# EAGLE board balancer (EAGLE 9.6.2), part 1 of 2
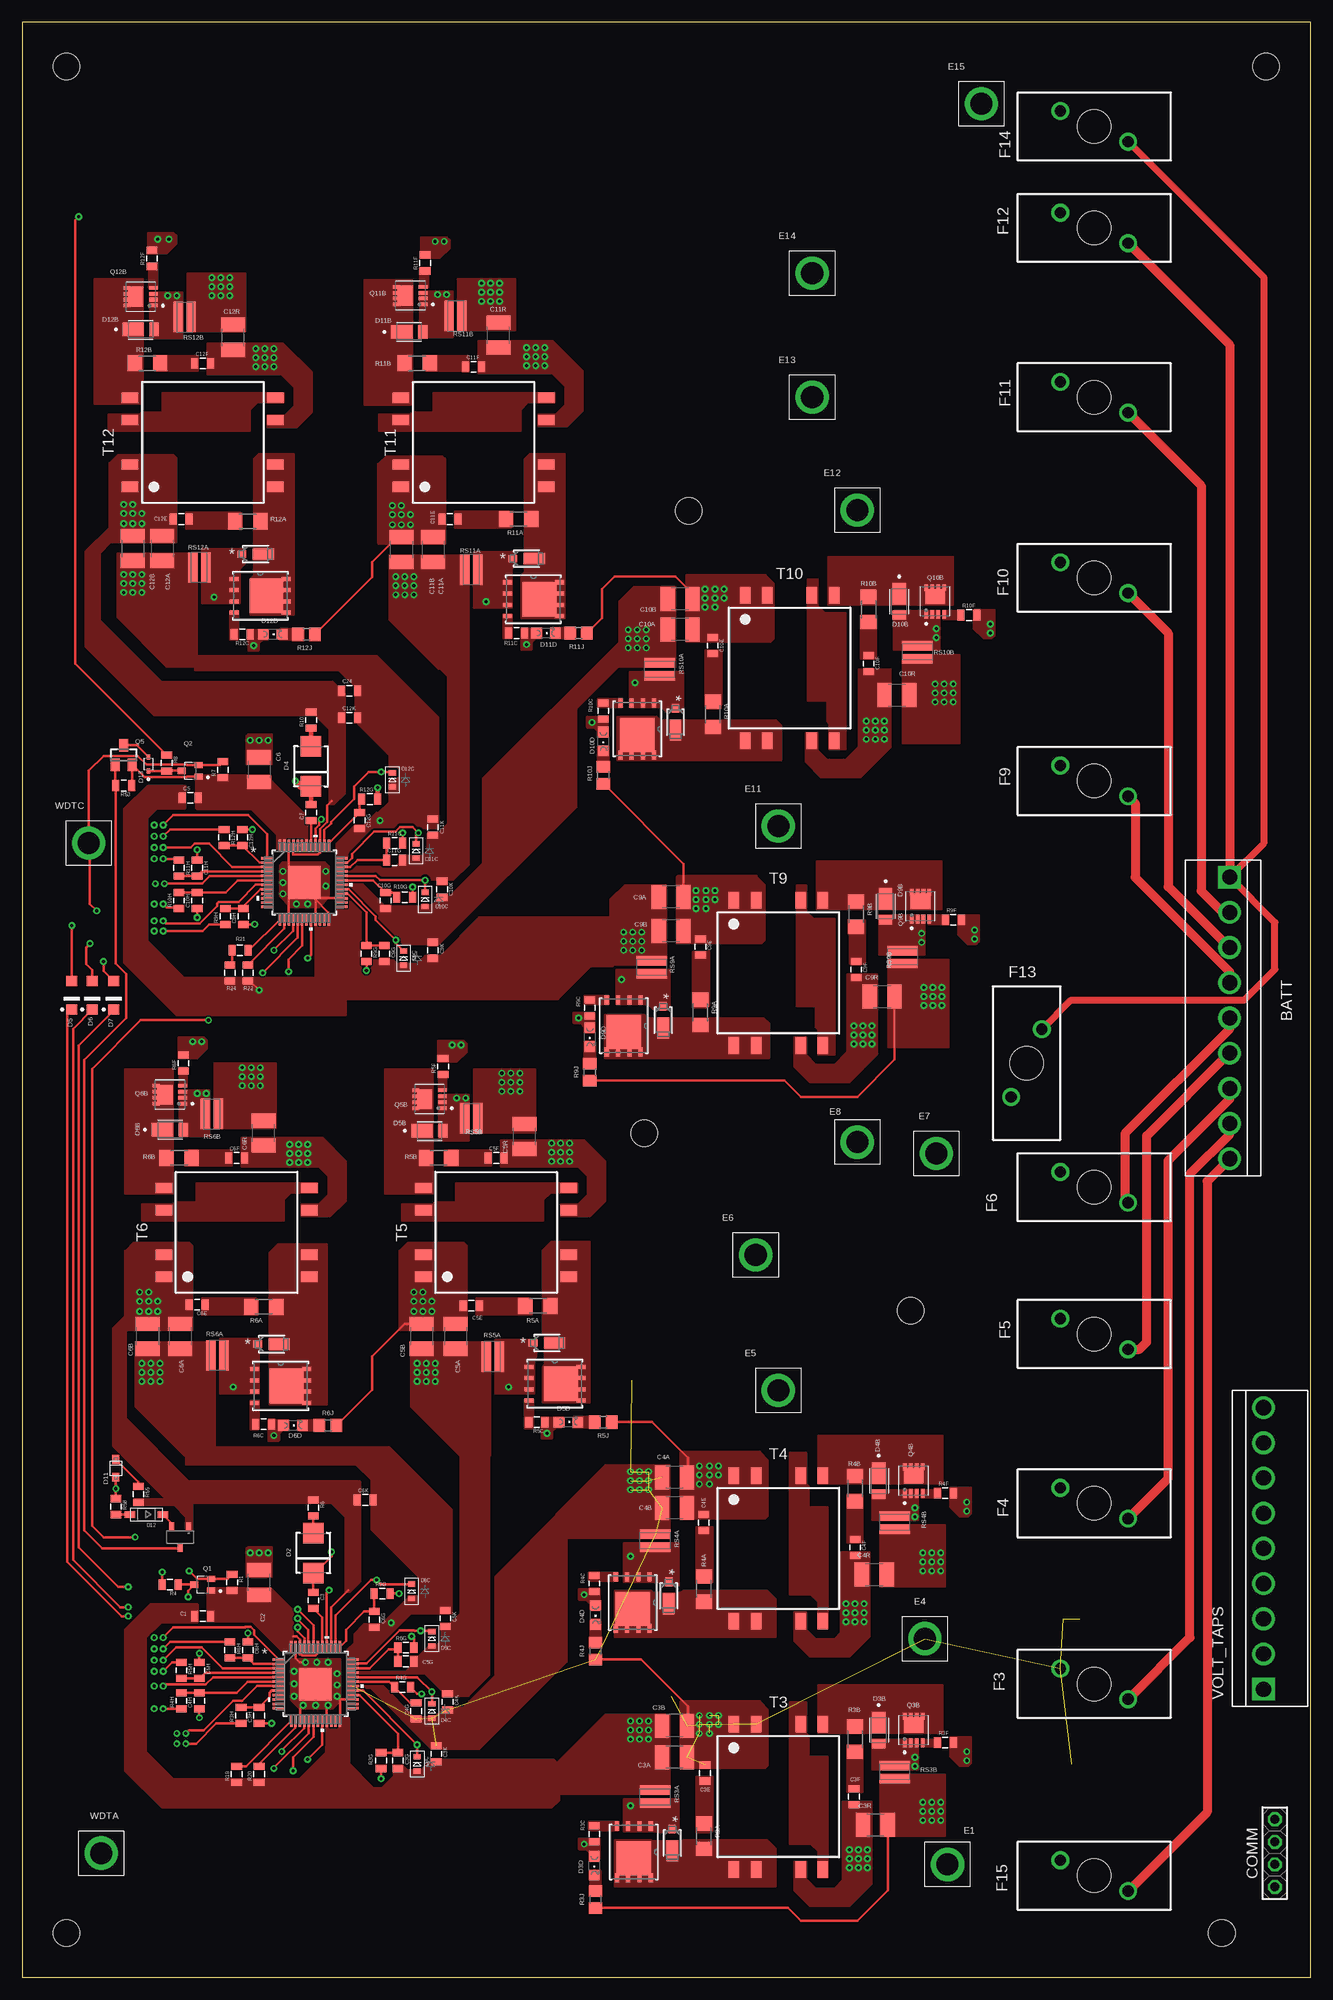
[diagram p1: board, top side]
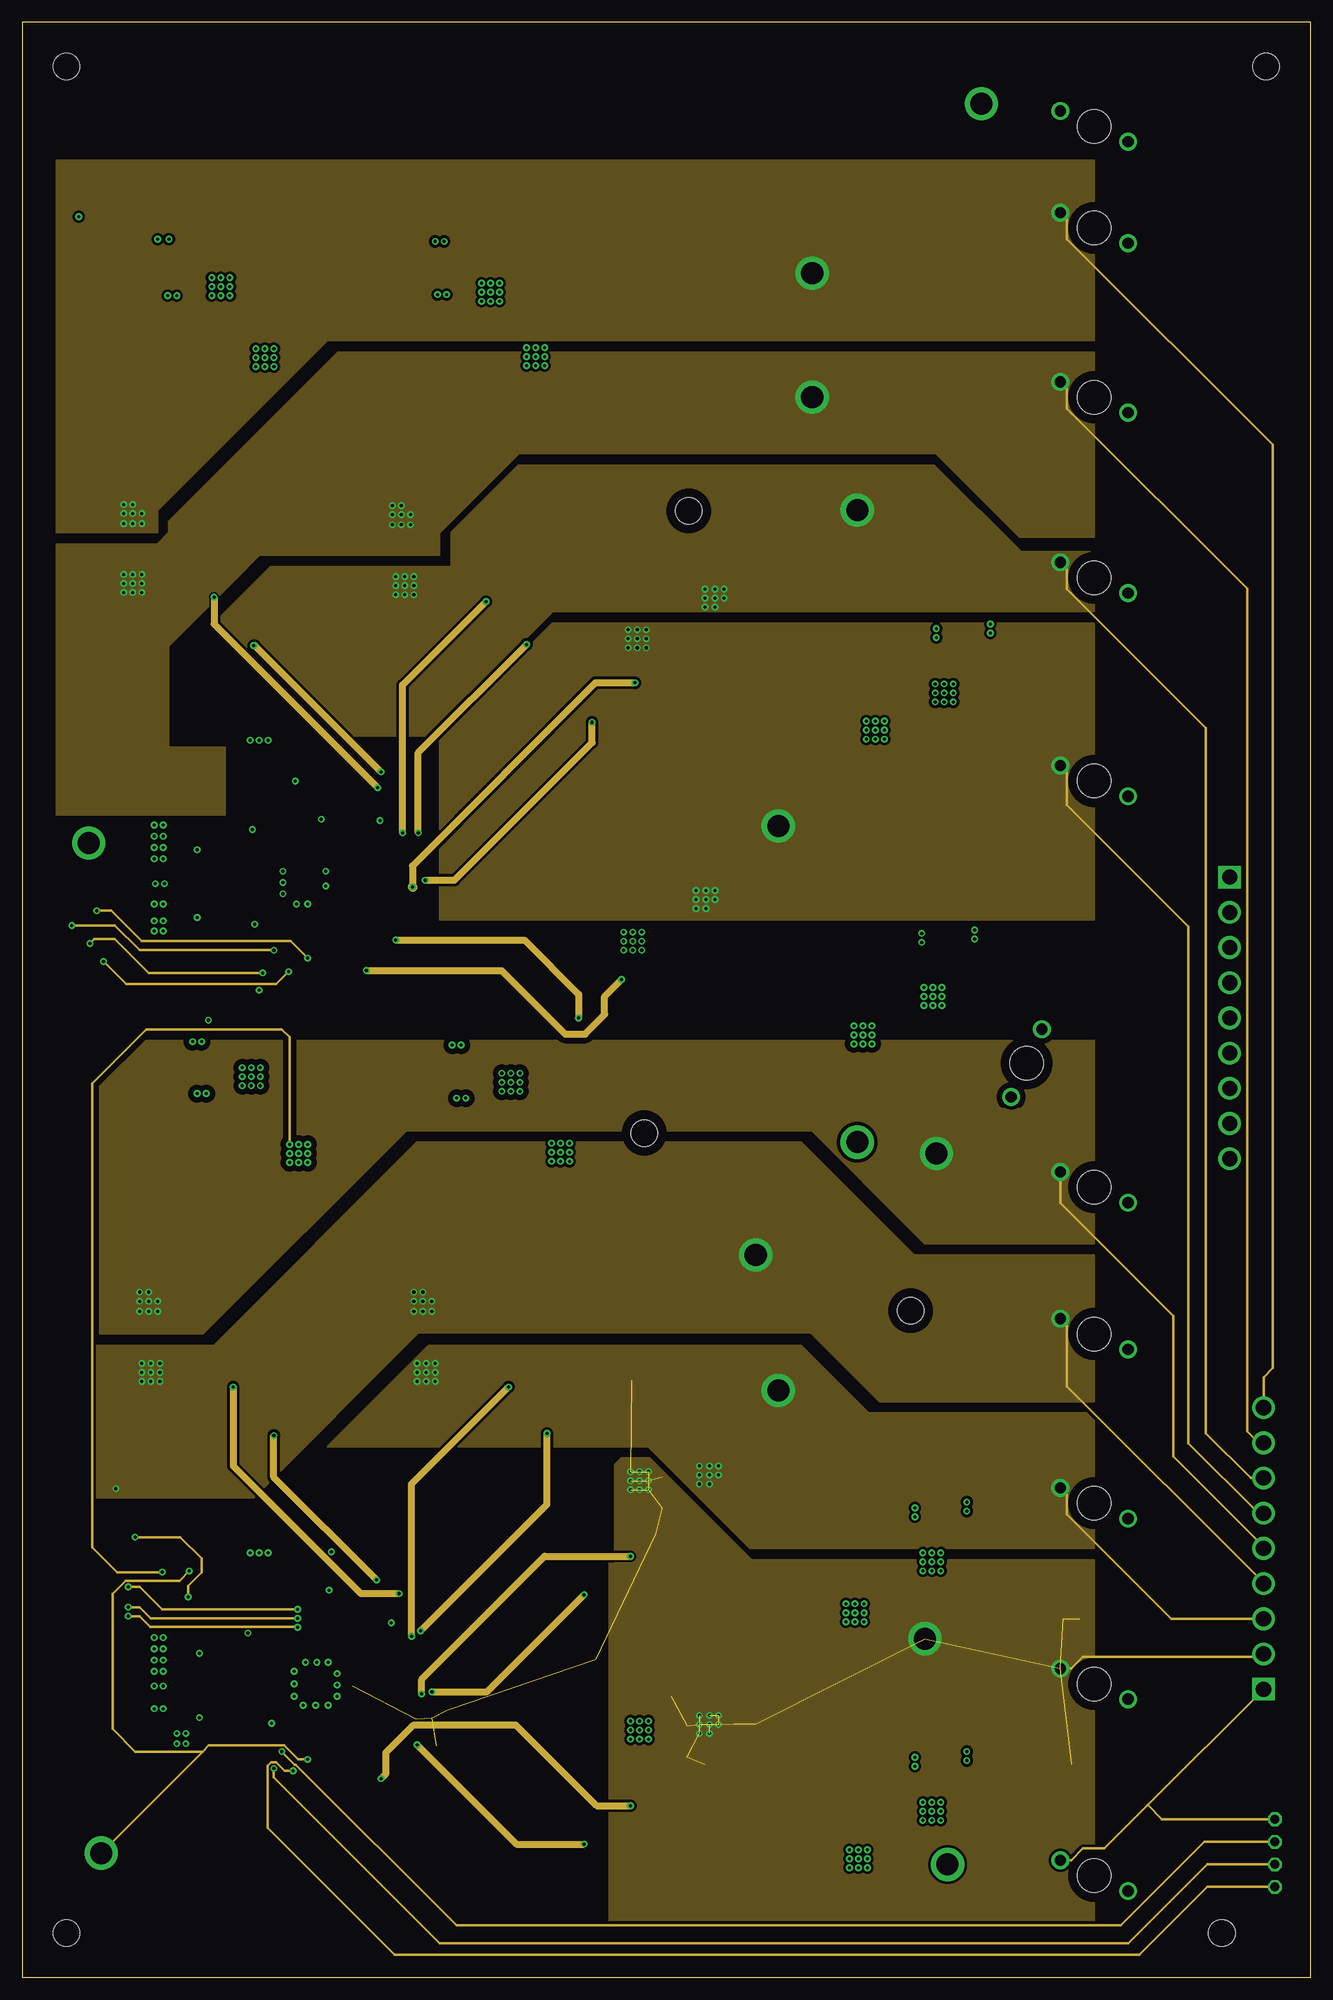
[diagram p2: board, inner layer Route2]
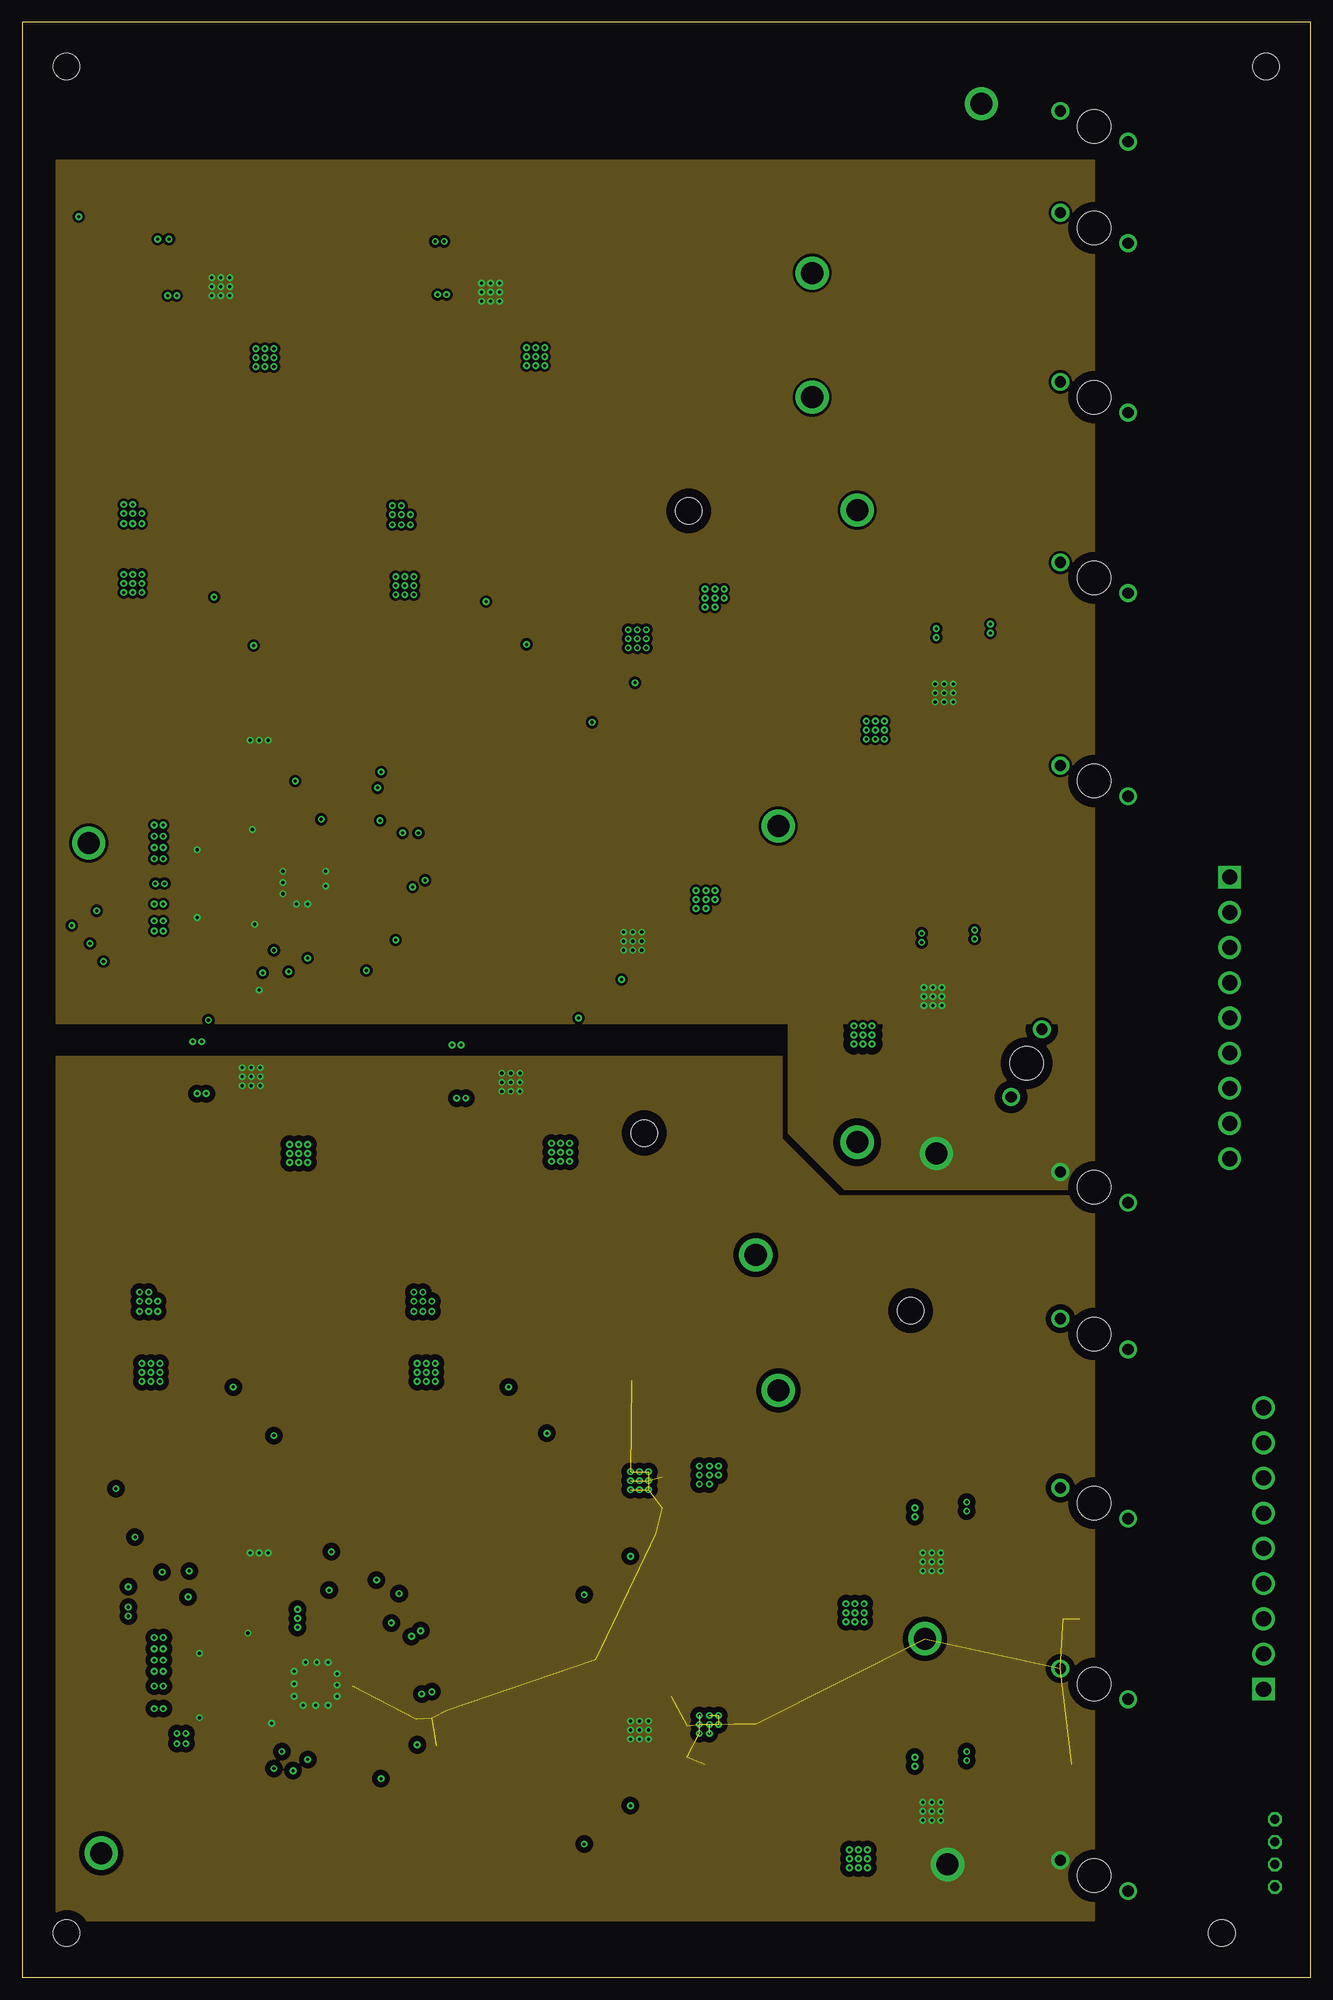
[diagram p3: board, inner layer Route15]
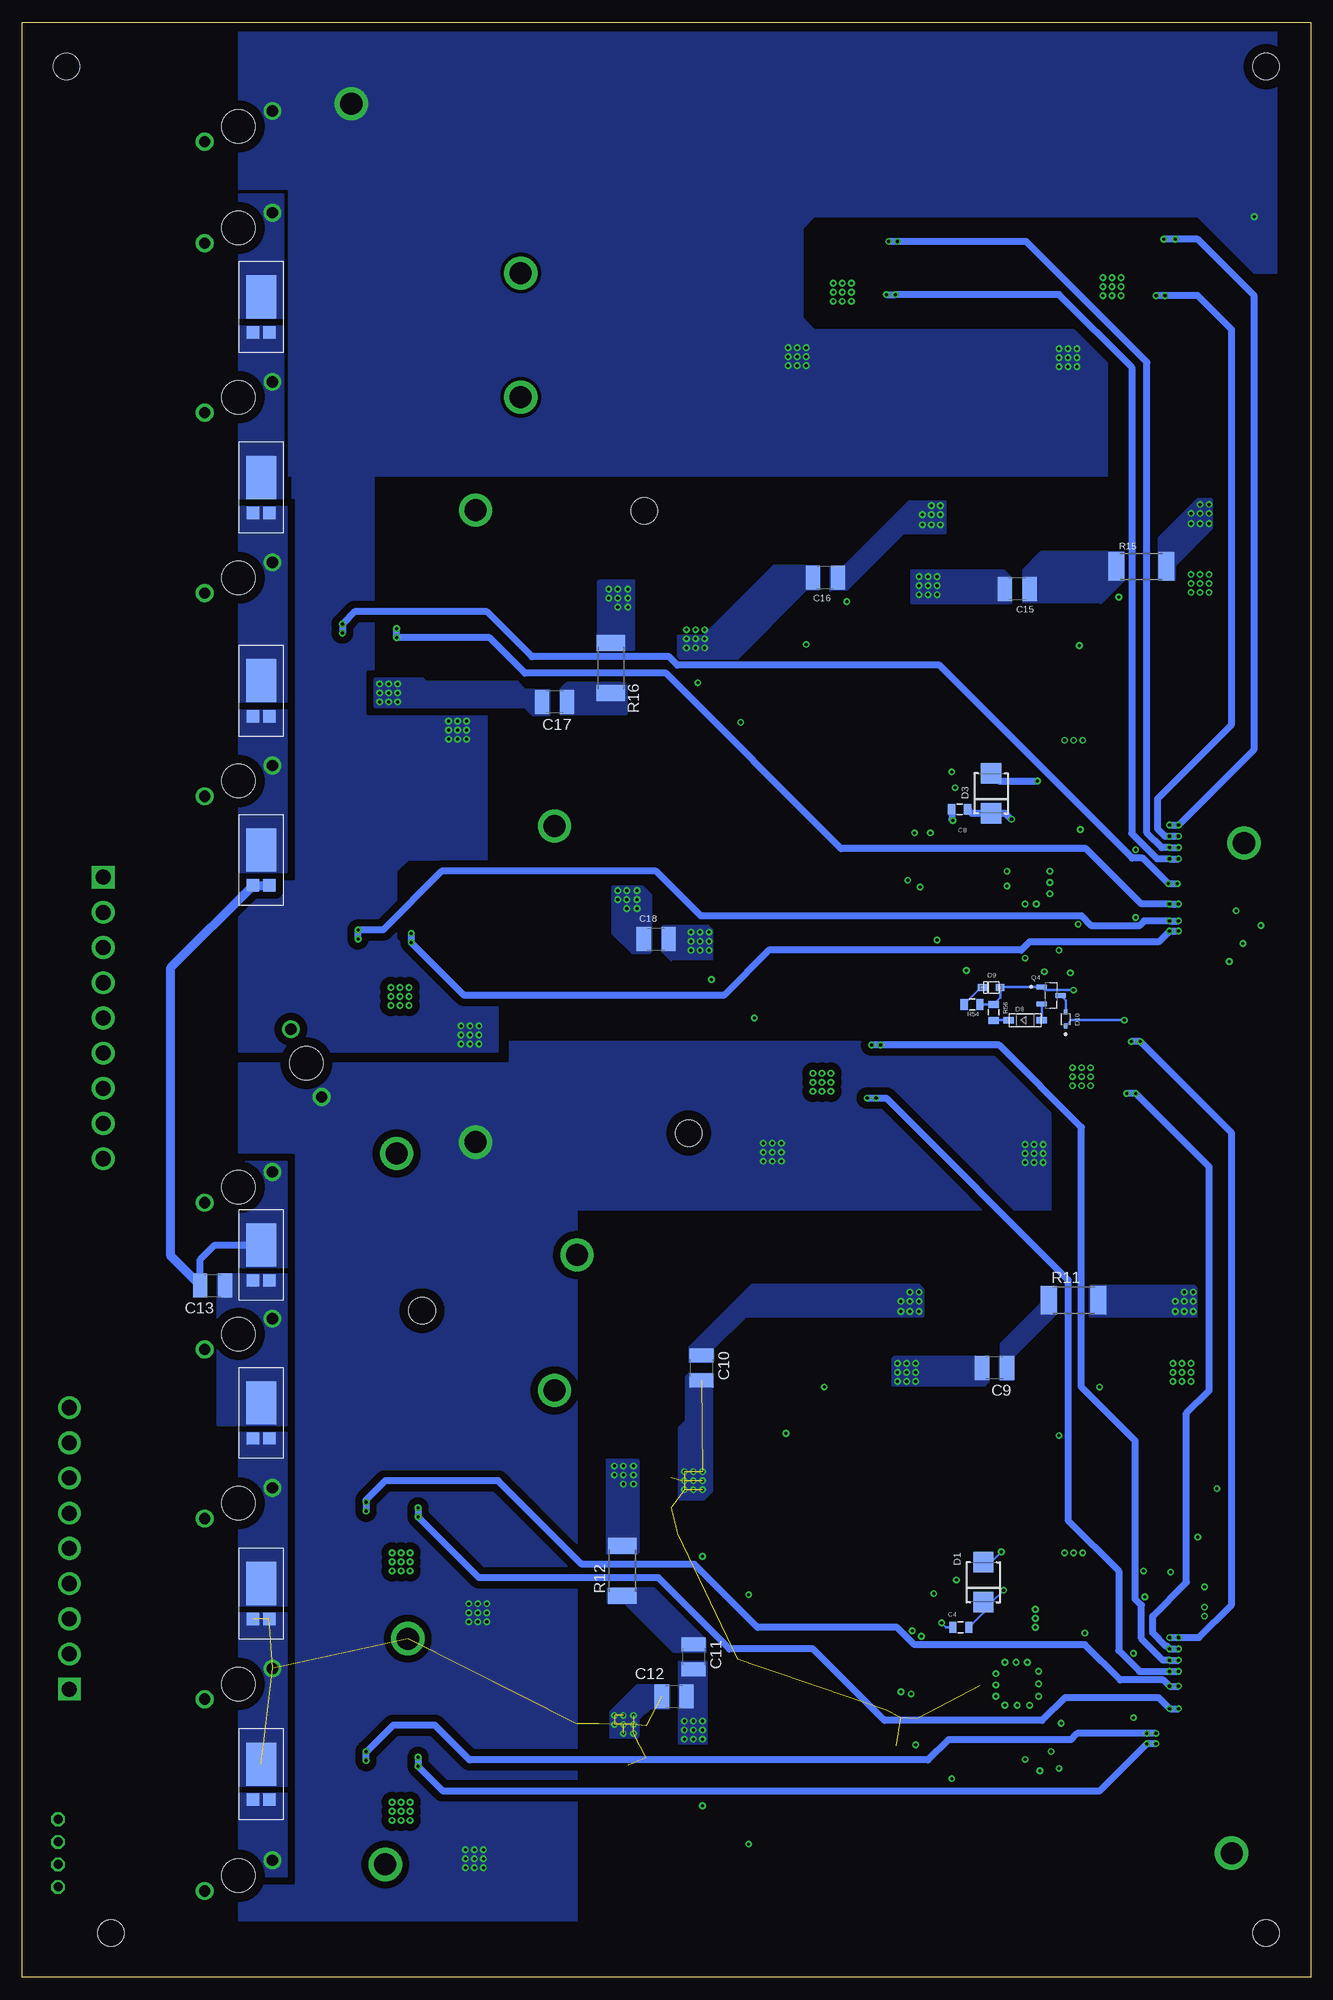
[diagram p4: board, bottom side, seen from below]

Size 145 x 220 mm. Coordinates in mm from the lower left corner, seen from the top.
Outline: 0,0 145,0 145,220 0,220 0,0
Copper layers (1+2*15+16): Top 0.07mm / dielectric 0.2mm / Route2 0.07mm / dielectric 1mm / Route15 0.07mm / dielectric 0.2mm / Bottom 0.07mm
Design rules "4layers": minimum track width 6mil, minimum drill 0.35mm, track to track 6mil, track to pad 6mil, pad to pad 6mil, via to via 6mil, smd to smd 6mil, copper to edge 40mil, drill to drill 6mil, minimum pad ring 10mil, minimum via ring 8mil, stop-mask expansion 4mil, vias tented up to drill 0mil, thermal gap 10mil
Holes 3 mm at 5,215 140,215 135,5 5,5 70,95 75,165 100,75

## Footprints (pad centres in the part's own frame; a part is rotated, then mirrored left to right if it is on the bottom)
B9P-VH = drill 1.7 square: 1 -15.84,0 | drill 1.7: 2 -11.88,0; 3 -7.92,0; 4 -3.96,0; 5 0,0; 6 3.96,0; 7 7.92,0; 8 11.88,0; 9 15.84,0
0805 = smd 0.8 x 1.2: 1 -0.9,0; 2 0.9,0
C1210 = smd 1.6 x 2.7: 1 -1.4,0; 2 1.4,0
1X04 = drill 1.016 octagon: 1 -3.81,0; 2 -1.27,0; 3 1.27,0; 4 3.81,0
WE-TVSP_DO-214AA_UNIDIRECTIONAL = smd 2.3 x 2.3: 1 -2.25,0; 2 2.25,0
SDO_POWERDI123_DIO = smd 0.991 x 0.787: 1 -1.562,0 | smd 2.388 x 1.27: 2 0.864,0
DIO_DFLS1100-7 = smd 1.05 x 1.5: A 1.525,0 | smd 2.4 x 1.5: K -0.85,0
SOD-523 = smd 0.8 x 0.6: A 0,-0.8; K 0,0.8
CHIPLED_0805 = smd 1.2 x 1.2: A 0,-1.05; C 0,1.05
POWERDI5 = smd 4.86 x 3.36: P$1 1.12,0 | smd 1.4 x 1.39: P$2 -2.862,0.92; P$3 -2.862,-0.92
SODFL3718X108N = smd 1.12 x 1.22: A 1.6,0; C -1.6,0
SOD-123 = smd 1.2 x 0.7: A 1.85,0; C -1.85,0
SOD-323F = smd 1 x 0.8: A -1,0; C 1,0
SODFL1608X65N = smd 0.56 x 0.4: A 0.785,0; C -0.785,0
MILMAX_2501-2-00-80-00-00-07-0 = drill 2.49 pad 3.74: 1 0,0
01530008 = drill 1.27 pad 2: 1 1.727,3.81; 2 -1.727,-3.81 | hole 3.785: 0,0
TRANS_BSS123W = smd 0.9 x 0.7: 1 -0.95,0.65; 2 -0.95,-0.65; 3 0.95,0
POWERPAK_SO-8_SINGLE_VIS = smd 1.016 x 0.457: 1 -2.921,1.905; 2 -2.921,0.635; 3 -2.921,-0.635; 4 -2.921,-1.905; 5 2.921,-1.905; 6 2.921,-0.635; 7 2.921,0.635; 8 2.921,1.905 | smd 3.81 x 3.91: 9 0.69,0
VISHAY_SIS468DN-T1-GE3 = smd 0.99 x 0.405: 1 -1.435,0.993; 2 -1.435,0.33; 3 -1.435,-0.33; 4 -1.435,-0.993 | smd 0.76 x 0.405: 5 1.55,-0.993; 6 1.55,-0.33; 7 1.55,0.33; 8 1.55,0.993 | smd 1.725 x 2.235: 9 0.557,0
SOT95P240X111-3N = smd 1.23 x 0.6: 1 -1.06,0.95; 2 -1.06,-0.95; 3 1.06,0
SSOT-3 = smd 1 x 1.4: 1 -0.95,-1.1; 2 0.95,-1.1; 3 0,1.1
CMPT-3904-NPN_CNS = smd 0.559 x 0.864: 1 -0.95,-1.245; 2 0.95,-1.245; 3 0,1.245
R1206 = smd 1.6 x 1.803: 1 -1.422,0; 2 1.422,0
R0805 = smd 1.3 x 1.5: 1 -0.95,0; 2 0.95,0
R2512 = smd 1.8 x 3.2: 1 -2.8,0; 2 2.8,0
RESC1632X60N = smd 1.06 x 3.42: 1 -0.728,0; 2 0.728,0
WE-FLYLT_EP13_2381 = smd 1.17 x 1.88: 1 -5,8.18; 2 -2.5,8.18; 4 2.5,8.18; 5 5,8.18; 6 5,-8.18; 7 2.5,-8.18; 9 -2.5,-8.18; 10 -5,-8.18
05-08-1832_ADI = smd 1.346 x 0.279: 1 -4.178,2.75; 2 -4.178,2.25; 3 -4.178,1.75; 4 -4.178,1.25; 5 -4.178,0.75; 6 -4.178,0.25; 7 -4.178,-0.25; 8 -4.178,-0.75; 9 -4.178,-1.25; 10 -4.178,-1.75; 11 -4.178,-2.25; 12 -4.178,-2.75; 25 4.178,-2.75; 26 4.178,-2.25; 27 4.178,-1.75; 28 4.178,-1.25; 29 4.178,-0.75; 30 4.178,-0.25; 31 4.178,0.25; 32 4.178,0.75; 33 4.178,1.25; 34 4.178,1.75; 35 4.178,2.25; 36 4.178,2.75 | smd 0.279 x 1.346: 13 -2.75,-4.178; 14 -2.25,-4.178; 15 -1.75,-4.178; 16 -1.25,-4.178; 17 -0.75,-4.178; 18 -0.25,-4.178; 19 0.25,-4.178; 20 0.75,-4.178; 21 1.25,-4.178; 22 1.75,-4.178; 23 2.25,-4.178; 24 2.75,-4.178; 37 2.75,4.178; 38 2.25,4.178; 39 1.75,4.178; 40 1.25,4.178; 41 0.75,4.178; 42 0.25,4.178; 43 -0.25,4.178; 44 -0.75,4.178; 45 -1.25,4.178; 46 -1.75,4.178; 47 -2.25,4.178; 48 -2.75,4.178 | smd 3.658 x 3.658: 49 0,0

## Placement (x,y rotation side)
BATT  [B9P-VH]  135.89,107.95 270 top
C1  1.0uF  [0805]  20.32,40.64 180 top
C2  4.7uF  [C1210]  26.67,44.45 90 top
C3  0.1uF  [0805]  32.77,42.42 270 top
C3A  100uF  [C1210]  73.41,24.77 180 top
C3B  100uF  [C1210]  73.41,28.32 180 top
C3E  470pF  [0805]  76.83,22.99 270 top
C3F  470pF  [0805]  93.6,20.32 270 top
C3G  2.2nF  [0805]  42.29,24.38 270 top
C3H  470pF  [0805]  26.67,29.46 90 top
C3K  1uF  [0805]  46.61,25.15 270 top
C3R  2.2uF  [C1210]  96.01,17.14 0 top
C4  0.22uF  [0805]  39.37,39.37 180 bottom
C4A  100uF  [C1210]  73.41,56.26 180 top
C4B  100uF  [C1210]  73.41,52.83 180 top
C4E  470pF  [0805]  76.71,51.18 270 top
C4F  470pF  [0805]  93.73,48.39 270 top
C4G  2.2nF  [0805]  44.32,29.97 270 top
C4H  470pF  [0805]  19.94,31.11 90 top
C4K  1uF  [0805]  47.88,30.99 270 top
C4R  2.2uF  [C1210]  95.89,45.34 0 top
C5  1.0uF  [0805]  18.92,132.72 0 top
C5A  100uF  [C1210]  48.77,72.14 270 top
C5B  100uF  [C1210]  44.96,72.14 270 top
C5E  470pF  [0805]  50.55,75.56 0 top
C5F  470pF  [0805]  53.34,92.2 0 top
C5G  2.2nF  [0805]  43.18,35.56 0 top
C5H  470pF  [0805]  19.94,34.54 270 top
C5K  1uF  [0805]  47.62,40.39 270 top
C5R  2.2uF  [C1210]  56.52,94.61 90 top
C6  4.7uF  [C1210]  26.67,135.89 270 top
C6A  100uF  [C1210]  17.78,72.14 270 top
C6B  100uF  [C1210]  14.1,72.14 270 top
C6E  470pF  [0805]  19.68,75.69 0 top
C6F  470pF  [0805]  24.13,92.2 0 top
C6G  2.2nF  [0805]  39.62,40.26 270 top
C6H  470pF  [0805]  25.4,36.83 270 top
C6K  1uF  [0805]  38.61,53.72 0 top
C6R  2.2uF  [C1210]  27.18,95 90 top
C7  0.1uF  [0805]  32.51,131.06 90 top
C8  0.22uF  [0805]  39.5,131.44 180 bottom
C9  4.7uF  [C1210]  35.56,68.58 180 bottom
C9A  100uF  [C1210]  73.03,121.54 180 top
C9B  100uF  [C1210]  73.03,117.73 180 top
C9E  470pF  [0805]  76.33,115.95 270 top
C9F  470pF  [0805]  93.85,113.41 270 top
C9G  2.2nF  [0805]  40.77,115.19 270 top
C9H  470pF  [0805]  24.89,119.38 90 top
C9K  1uF  [0805]  46.23,115.57 270 top
C9R  2.2uF  [C1210]  96.77,110.36 0 top
C10  4.7uF  [C1210]  68.58,68.58 270 bottom
C10A  100uF  [C1210]  74.04,155.07 180 top
C10B  100uF  [C1210]  74.04,151.64 180 top
C10E  470pF  [0805]  77.72,149.86 270 top
C10F  470pF  [0805]  95.25,147.83 270 top
C10G  2.2nF  [0805]  40.89,121.16 270 top
C10H  470pF  [0805]  19.68,121.16 90 top
C10K  1uF  [0805]  47.24,122.43 270 top
C10R  2.2uF  [C1210]  98.42,144.27 0 top
C11  4.7uF  [C1210]  69.47,36.07 270 bottom
C11A  100uF  [C1210]  46.23,160.66 270 top
C11B  100uF  [C1210]  42.67,160.66 270 top
C11E  470pF  [0805]  48.13,164.08 0 top
C11F  470pF  [0805]  50.8,181.23 0 top
C11G  2.2nF  [0805]  41.91,125.73 0 top
C11H  470pF  [0805]  19.68,124.84 270 top
C11K  1uF  [0805]  46.23,129.41 270 top
C11R  2.2uF  [C1210]  53.59,184.78 90 top
C12  4.7uF  [C1210]  71.63,31.62 0 bottom
C12A  100uF  [C1210]  15.75,160.78 270 top
C12B  100uF  [C1210]  12.45,160.78 270 top
C12E  470pF  [0805]  17.91,164.08 0 top
C12F  470pF  [0805]  20.32,181.61 0 top
C12G  2.2nF  [0805]  37.97,130.18 270 top
C12H  470pF  [0805]  24.77,128.27 270 top
C12K  1uF  [0805]  36.83,141.73 0 top
C12R  2.2uF  [C1210]  23.75,184.53 90 top
C13  4.7uF  [C1210]  123.57,77.85 0 bottom
C15  4.7uF  [C1210]  33.02,156.21 180 bottom
C16  4.7uF  [C1210]  54.61,157.48 180 bottom
C17  4.7uF  [C1210]  85.09,143.51 180 bottom
C18  4.7uF  [C1210]  73.66,116.84 0 bottom
C24  10uF  [0805]  36.83,144.78 0 top
COMM  PINHD-1X4  [1X04]  140.97,13.97 90 top
D1  WE-TVSP_DO-214AA_600W_UNI  [WE-TVSP_DO-214AA_UNIDIRECTIONAL]  36.83,44.45 90 bottom
D2  WE-TVSP_DO-214AA_600W_UNI  [WE-TVSP_DO-214AA_UNIDIRECTIONAL]  32.77,47.75 90 top
D3  WE-TVSP_DO-214AA_600W_UNI  [WE-TVSP_DO-214AA_UNIDIRECTIONAL]  35.94,133.22 90 bottom
D3A  DFLS260Q-7  [SDO_POWERDI123_DIO]  73.15,15.11 270 top
D3B  DFLS1100-7  [DIO_DFLS1100-7]  96.39,27.81 270 top
D3C  [SOD-523]  44.45,24 0 top
D3D  [CHIPLED_0805]  64.39,12.57 180 top
D3E  SBR10U200P5  [POWERDI5]  118.11,22.86 90 bottom
D4  WE-TVSP_DO-214AA_600W_UNI  [WE-TVSP_DO-214AA_UNIDIRECTIONAL]  32.51,136.27 90 top
D4A  DFLS260Q-7  [SDO_POWERDI123_DIO]  72.77,42.93 270 top
D4B  DFLS1100-7  [DIO_DFLS1100-7]  96.39,55.88 270 top
D4C  [SOD-523]  46.1,29.97 0 top
D4D  [CHIPLED_0805]  64.52,40.77 180 top
D4E  SBR10U200P5  [POWERDI5]  118.11,43.18 90 bottom
D5  RS07J-GS18  [SODFL3718X108N]  5.59,110.49 90 top
D5A  DFLS260Q-7  [SDO_POWERDI123_DIO]  59.05,71.37 0 top
D5B  DFLS1100-7  [DIO_DFLS1100-7]  45.85,95.25 0 top
D5C  [SOD-523]  46.1,38.1 0 top
D5D  [CHIPLED_0805]  61.47,62.48 270 top
D5E  SBR10U200P5  [POWERDI5]  118.11,63.5 90 bottom
D6  RS07J-GS18  [SODFL3718X108N]  7.87,110.49 90 top
D6A  DFLS260Q-7  [SDO_POWERDI123_DIO]  28.07,71.25 0 top
D6B  DFLS1100-7  [DIO_DFLS1100-7]  16.64,95.38 0 top
D6C  [SOD-523]  43.81,43.43 0 top
D6D  [CHIPLED_0805]  30.48,62.1 270 top
D6E  SBR10U200P5  [POWERDI5]  118.11,81.28 90 bottom
D7  RS07J-GS18  [SODFL3718X108N]  10.29,110.49 90 top
D8  CMHZ4689  [SOD-123]  32.13,107.7 0 bottom
D9  PDZ5.6B  [SOD-323F]  35.94,111.38 180 bottom
D9A  DFLS260Q-7  [SDO_POWERDI123_DIO]  72.14,107.7 270 top
D9B  DFLS1100-7  [DIO_DFLS1100-7]  97.16,120.52 270 top
D9C  [SOD-523]  42.93,114.68 0 top
D9D  [CHIPLED_0805]  63.88,105.79 180 top
D9E  SBR10U200P5  [POWERDI5]  118.11,125.73 90 bottom
D10  1N4448HWT-7  [SODFL1608X65N]  27.56,107.82 90 bottom
D10A  DFLS260Q-7  [SDO_POWERDI123_DIO]  73.53,141.22 270 top
D10B  DFLS1100-7  [DIO_DFLS1100-7]  98.68,154.81 270 top
D10C  [SOD-523]  45.34,121.28 0 top
D10D  [CHIPLED_0805]  65.41,139.06 180 top
D10E  SBR10U200P5  [POWERDI5]  118.11,144.78 90 bottom
D11  PDZ5.6B  [SOD-323F]  10.54,57.28 90 top
D11A  DFLS260Q-7  [SDO_POWERDI123_DIO]  56.77,159.64 0 top
D11B  DFLS1100-7  [DIO_DFLS1100-7]  43.56,185.17 0 top
D11C  [SOD-523]  44.32,126.75 0 top
D11D  [CHIPLED_0805]  58.93,151.26 270 top
D11E  SBR10U200P5  [POWERDI5]  118.11,167.64 90 bottom
D12  CMHZ4689  [SOD-123]  13.97,52.07 180 top
D12A  DFLS260Q-7  [SDO_POWERDI123_DIO]  26.29,160.15 0 top
D12B  DFLS1100-7  [DIO_DFLS1100-7]  13.34,185.42 0 top
D12C  [SOD-523]  41.66,134.75 0 top
D12D  [CHIPLED_0805]  28.19,151.13 270 top
D12E  SBR10U200P5  [POWERDI5]  118.11,187.96 90 bottom
D13  1N4448HWT-7  [SODFL1608X65N]  14.22,136.53 90 top
E1  2501-2-00-80-00-00-07-0  [MILMAX_2501-2-00-80-00-00-07-0]  104.14,12.7 0 top
E4  2501-2-00-80-00-00-07-0  [MILMAX_2501-2-00-80-00-00-07-0]  101.6,38.1 0 top
E5  2501-2-00-80-00-00-07-0  [MILMAX_2501-2-00-80-00-00-07-0]  85.09,66.04 0 top
E6  2501-2-00-80-00-00-07-0  [MILMAX_2501-2-00-80-00-00-07-0]  82.55,81.28 0 top
E7  2501-2-00-80-00-00-07-0  [MILMAX_2501-2-00-80-00-00-07-0]  102.87,92.71 0 top
E8  2501-2-00-80-00-00-07-0  [MILMAX_2501-2-00-80-00-00-07-0]  93.98,93.98 0 top
E11  2501-2-00-80-00-00-07-0  [MILMAX_2501-2-00-80-00-00-07-0]  85.09,129.54 0 top
E12  2501-2-00-80-00-00-07-0  [MILMAX_2501-2-00-80-00-00-07-0]  93.98,165.1 0 top
E13  2501-2-00-80-00-00-07-0  [MILMAX_2501-2-00-80-00-00-07-0]  88.9,177.8 0 top
E14  2501-2-00-80-00-00-07-0  [MILMAX_2501-2-00-80-00-00-07-0]  88.9,191.77 0 top
E15  2501-2-00-80-00-00-07-0  [MILMAX_2501-2-00-80-00-00-07-0]  107.95,210.82 0 top
F3  01530008Z  [01530008]  120.65,33.02 270 top
F4  01530008Z  [01530008]  120.65,53.34 90 top
F5  01530008Z  [01530008]  120.65,72.39 270 top
F6  01530008Z  [01530008]  120.65,88.9 90 top
F9  01530008Z  [01530008]  120.65,134.62 270 top
F10  01530008Z  [01530008]  120.65,157.48 90 top
F11  01530008Z  [01530008]  120.65,177.8 270 top
F12  01530008Z  [01530008]  120.65,196.85 90 top
F13  01530008Z  [01530008]  113.03,102.87 0 top
F14  01530008Z  [01530008]  120.65,208.28 270 top
F15  01530008Z  [01530008]  120.65,11.43 90 top
Q1  BSS123W  [TRANS_BSS123W]  20.32,44.2 180 top
Q2  BSS123W  [TRANS_BSS123W]  18.92,135.76 180 top
Q3A  SIR882DP-T1-GE3  [POWERPAK_SO-8_SINGLE_VIS]  68.83,14.1 270 top
Q3B  SIS468DN-T1-GE3  [VISHAY_SIS468DN-T1-GE3]  100.33,27.81 90 top
Q4  MMBT3906LT1G  [SOT95P240X111-3N]  29.21,110.49 0 bottom
Q4A  SIR882DP-T1-GE3  [POWERPAK_SO-8_SINGLE_VIS]  68.71,42.16 270 top
Q4B  SIS468DN-T1-GE3  [VISHAY_SIS468DN-T1-GE3]  100.33,55.88 90 top
Q5  FDN5618P  [SSOT-3]  11.43,137.54 0 top
Q5A  SIR882DP-T1-GE3  [POWERPAK_SO-8_SINGLE_VIS]  59.94,66.8 0 top
Q5B  SIS468DN-T1-GE3  [VISHAY_SIS468DN-T1-GE3]  45.85,98.81 180 top
Q6  CMPT3904E_TR_PBFREE  [CMPT-3904-NPN_CNS]  17.78,49.53 180 top
Q6A  SIR882DP-T1-GE3  [POWERPAK_SO-8_SINGLE_VIS]  29.08,66.55 0 top
Q6B  SIS468DN-T1-GE3  [VISHAY_SIS468DN-T1-GE3]  16.64,99.31 180 top
Q9A  SIR882DP-T1-GE3  [POWERPAK_SO-8_SINGLE_VIS]  67.69,107.06 270 top
Q9B  SIS468DN-T1-GE3  [VISHAY_SIS468DN-T1-GE3]  101.09,120.52 90 top
Q10A  SIR882DP-T1-GE3  [POWERPAK_SO-8_SINGLE_VIS]  69.22,140.46 270 top
Q10B  SIS468DN-T1-GE3  [VISHAY_SIS468DN-T1-GE3]  102.74,154.81 90 top
Q11A  SIR882DP-T1-GE3  [POWERPAK_SO-8_SINGLE_VIS]  57.53,155.07 0 top
Q11B  SIS468DN-T1-GE3  [VISHAY_SIS468DN-T1-GE3]  43.69,189.23 180 top
Q12A  SIR882DP-T1-GE3  [POWERPAK_SO-8_SINGLE_VIS]  26.8,155.45 0 top
Q12B  SIS468DN-T1-GE3  [VISHAY_SIS468DN-T1-GE3]  13.34,189.1 180 top
R1  1M  [0805]  23.62,44.45 270 top
R3A  20  [R1206]  76.71,15.88 270 top
R3B  20  [R1206]  93.73,26.8 270 top
R3C  5.1  [0805]  64.39,16.13 90 top
R3F  5.1  [0805]  103.89,26.42 0 top
R3G  20  [0805]  40.39,24.38 270 top
R3H  20  [0805]  24.64,29.46 90 top
R3J  2k  [R0805]  64.52,8.76 90 top
R4  1.27M  [0805]  16.64,44.2 180 top
R4A  20  [R1206]  76.71,43.69 270 top
R4B  20  [R1206]  93.73,54.99 270 top
R4C  5.1  [0805]  64.39,44.32 90 top
R4F  5.1  [0805]  103.89,54.48 0 top
R4G  20  [0805]  42.8,32.64 0 top
R4H  20  [0805]  17.91,31.11 90 top
R4J  2k  [R0805]  64.52,36.7 90 top
R5A  20  [R1206]  58.04,75.56 0 top
R5B  20  [R1206]  46.86,92.2 0 top
R5C  5.1  [0805]  57.91,62.48 180 top
R5F  5.1  [0805]  47.37,102.49 90 top
R5G  20  [0805]  43.18,37.08 0 top
R5H  20  [0805]  17.91,34.54 270 top
R5J  2k  [R0805]  65.41,62.48 180 top
R6  6.81  [0805]  32.77,52.83 270 top
R6A  20  [R1206]  27.18,75.44 0 top
R6B  20  [R1206]  17.65,92.2 0 top
R6C  5.1  [0805]  27.18,62.23 180 top
R6F  5.1  [0805]  18.16,102.87 90 top
R6G  20  [0805]  40.51,43.18 0 top
R6H  20  [0805]  23.37,36.83 270 top
R6J  2k  [R0805]  34.42,62.1 180 top
R7  1M  [0805]  22.61,135.89 90 top
R8  1.27M  [0805]  16.26,136.65 270 top
R9A  20  [R1206]  76.33,108.58 270 top
R9B  20  [R1206]  93.85,119.63 270 top
R9C  5.1  [0805]  63.88,109.09 90 top
R9F  5.1  [0805]  104.78,119 0 top
R9G  20  [0805]  38.73,115.19 270 top
R9H  20  [0805]  22.86,119.38 90 top
R9J  2k  [R0805]  63.88,101.85 90 top
R10  6.81  [0805]  32.51,141.48 90 top
R10A  20  [R1206]  77.72,142.11 270 top
R10B  20  [R1206]  95.25,153.92 270 top
R10C  5.1  [0805]  65.41,142.49 90 top
R10F  5.1  [0805]  106.55,153.29 0 top
R10G  20  [0805]  43.05,121.54 0 top
R10H  20  [0805]  17.65,121.16 90 top
R10J  2k  [R0805]  65.41,135.25 90 top
R11  0  [R2512]  26.67,76.2 0 bottom
R11A  20  [R1206]  55.88,164.08 0 top
R11B  20  [R1206]  44.45,181.61 0 top
R11C  5.1  [0805]  55.63,151.26 180 top
R11F  5.1  [0805]  45.34,192.91 90 top
R11G  20  [0805]  41.91,127.64 0 top
R11H  20  [0805]  17.65,124.84 270 top
R11J  2k  [R0805]  62.61,151.26 180 top
R12  0  [R2512]  77.47,45.72 90 bottom
R12A  20  [R1206]  25.4,163.83 0 top
R12B  20  [R1206]  14.1,181.61 0 top
R12C  5.1  [0805]  24.77,151.13 180 top
R12F  5.1  [0805]  14.61,193.42 90 top
R12G  20  [0805]  39.12,132.59 0 top
R12H  20  [0805]  22.73,128.27 270 top
R12J  2k  [R0805]  32,151.13 180 top
R15  0  [R2512]  19.05,158.75 0 bottom
R16  0  [R2512]  78.74,147.32 90 bottom
R19  23.7k  [0805]  24.13,22.86 90 top
R20  33.2k  [0805]  26.67,22.86 90 top
R21  23.7k  [0805]  24.51,115.57 180 top
R22  33.2k  [0805]  25.4,113.03 270 top
R24  23.7k  [0805]  23.37,113.03 270 top
R53  100k  [0805]  11.43,134.11 180 top
R54  20  [0805]  38.1,109.47 180 bottom
R55  20  [0805]  13.08,54.36 270 top
R56  2k  [0805]  35.69,108.58 270 bottom
R58  2k  [0805]  10.54,52.96 270 top
RS3A  0.005  [RESC1632X60N]  71.25,20.32 270 top
RS3B  0.01  [RESC1632X60N]  98.17,23.11 90 top
RS4A  0.005  [RESC1632X60N]  71.25,49.15 270 top
RS4B  0.01  [RESC1632X60N]  98.17,51.18 90 top
RS5A  0.005  [RESC1632X60N]  52.96,69.85 0 top
RS5B  0.01  [RESC1632X60N]  50.55,96.65 180 top
RS6A  0.005  [RESC1632X60N]  21.97,69.98 0 top
RS6B  0.01  [RESC1632X60N]  21.34,97.16 180 top
RS9A  0.005  [RESC1632X60N]  70.87,113.67 270 top
RS9B  0.01  [RESC1632X60N]  99.06,114.81 90 top
RS10A  0.005  [RESC1632X60N]  71.75,147.19 270 top
RS10B  0.01  [RESC1632X60N]  100.71,149.1 90 top
RS11A  0.005  [RESC1632X60N]  50.55,158.37 0 top
RS11B  0.01  [RESC1632X60N]  48.77,186.94 180 top
RS12A  0.005  [RESC1632X60N]  19.94,158.62 0 top
RS12B  0.01  [RESC1632X60N]  18.29,186.82 180 top
T3  750312504  [WE-FLYLT_EP13_2381]  85.09,20.32 0 top
T4  750312504  [WE-FLYLT_EP13_2381]  85.09,48.26 0 top
T5  750312504  [WE-FLYLT_EP13_2381]  53.34,83.82 90 top
T6  750312504  [WE-FLYLT_EP13_2381]  24.13,83.82 90 top
T9  750312504  [WE-FLYLT_EP13_2381]  85.09,113.03 0 top
T10  750312504  [WE-FLYLT_EP13_2381]  86.36,147.32 0 top
T11  750312504  [WE-FLYLT_EP13_2381]  50.8,172.72 90 top
T12  750312504  [WE-FLYLT_EP13_2381]  20.32,172.72 90 top
U1  LTC3300ILXE-1PBF  [05-08-1832_ADI]  33.02,33.02 0 top
U2  LTC3300ILXE-1PBF  [05-08-1832_ADI]  31.75,123.19 0 top
VOLT_TAPS  [B9P-VH]  139.7,48.26 90 top
WDTA  2501-2-00-80-00-00-07-0  [MILMAX_2501-2-00-80-00-00-07-0]  8.89,13.97 0 top
WDTC  2501-2-00-80-00-00-07-0  [MILMAX_2501-2-00-80-00-00-07-0]  7.49,127.64 0 top